# Altium schematic sheet DriverBoard.SchDoc
size C
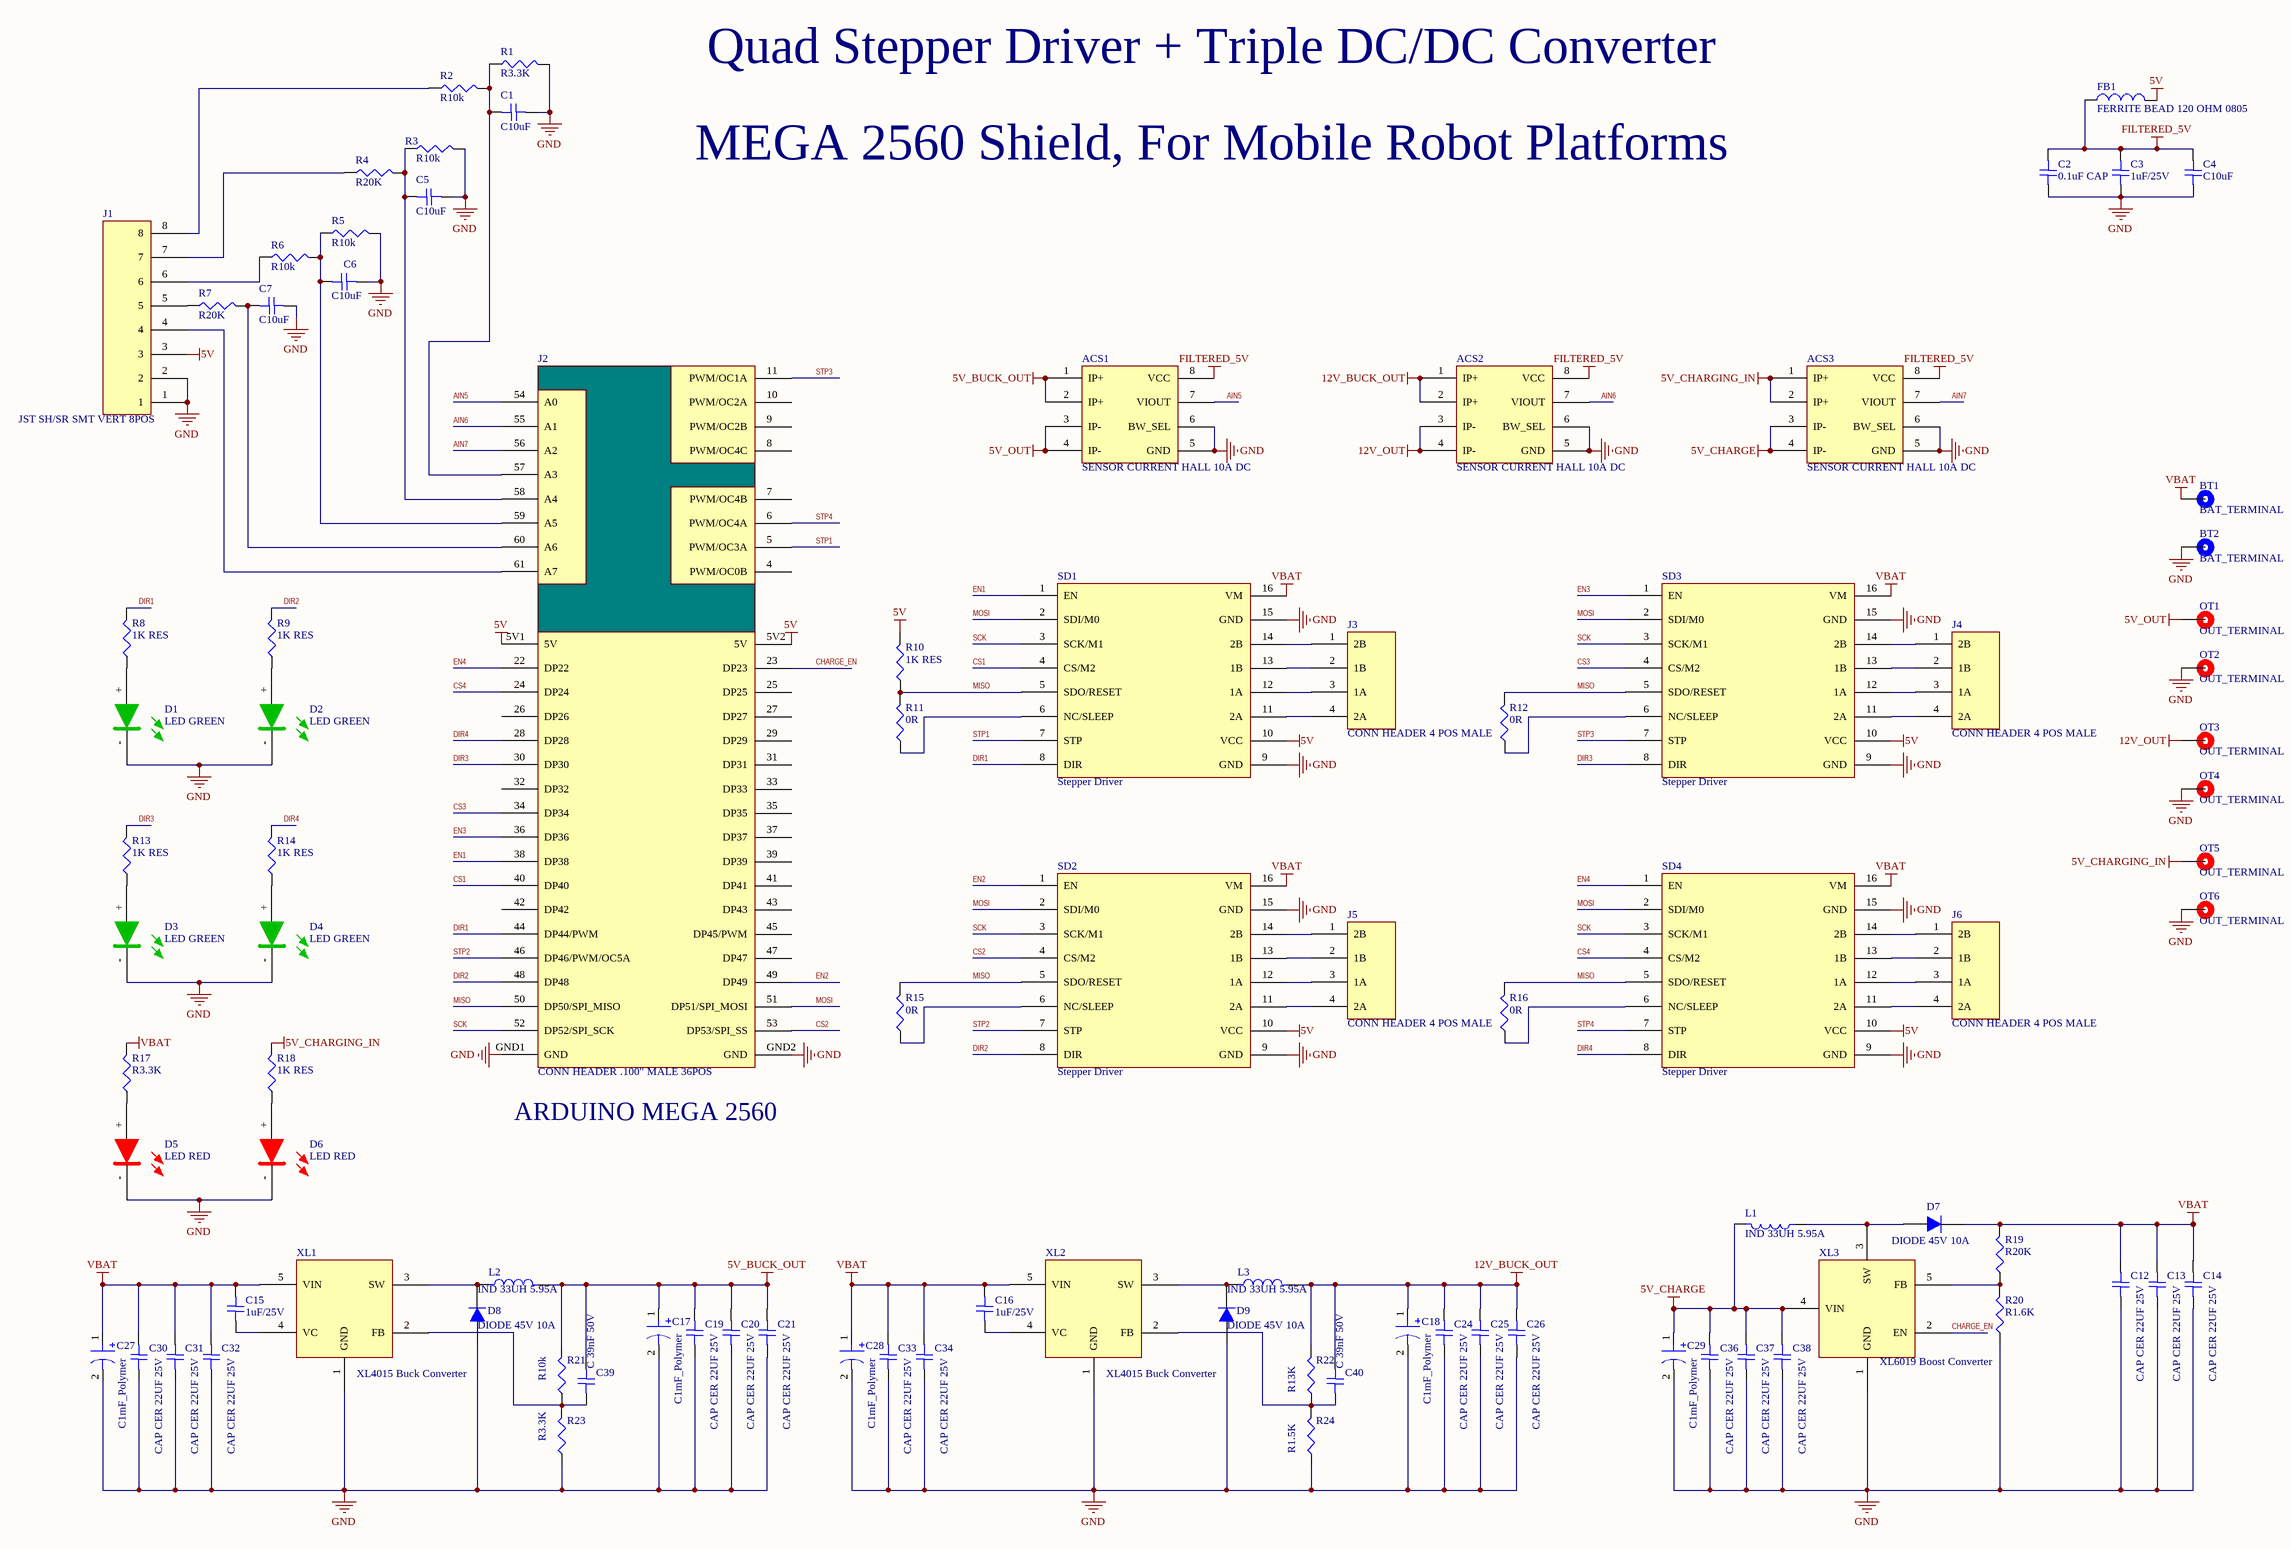
[diagram p0: DriverBoard.SchDoc]

## Parts
ACS1  SENSOR CURRENT HALL 10A DC  [SOIC_8]
ACS2  SENSOR CURRENT HALL 10A DC  [SOIC_8]
ACS3  SENSOR CURRENT HALL 10A DC  [SOIC_8]
BT1  BAT_TERMINAL  [BATTERY_TERMINALS]
BT2  BAT_TERMINAL  [BATTERY_TERMINALS]
C1  C10uF  [C0805]
C2  0.1uF CAP  [C0805]
C3  1uF/25V  [C0805]
C4  C10uF  [C0805]
C5  C10uF  [C0805]
C6  C10uF  [C0805]
C7  C10uF  [C0805]
C12  CAP CER 22UF 25V  [C1210]
C13  CAP CER 22UF 25V  [C1210]
C14  CAP CER 22UF 25V  [C1210]
C15  1uF/25V  [C0805]
C16  1uF/25V  [C0805]
C17  C1mF_Polymer  [POLY_CAP_10X21]
C18  C1mF_Polymer  [POLY_CAP_10X21]
C19  CAP CER 22UF 25V  [C1210]
C20  CAP CER 22UF 25V  [C1210]
C21  CAP CER 22UF 25V  [C1210]
C24  CAP CER 22UF 25V  [C1210]
C25  CAP CER 22UF 25V  [C1210]
C26  CAP CER 22UF 25V  [C1210]
C27  C1mF_Polymer  [POLY_CAP_10X21]
C28  C1mF_Polymer  [POLY_CAP_10X21]
C29  C1mF_Polymer  [POLY_CAP_10X21]
C30  CAP CER 22UF 25V  [C1210]
C31  CAP CER 22UF 25V  [C1210]
C32  CAP CER 22UF 25V  [C1210]
C33  CAP CER 22UF 25V  [C1210]
C34  CAP CER 22UF 25V  [C1210]
C36  CAP CER 22UF 25V  [C1210]
C37  CAP CER 22UF 25V  [C1210]
C38  CAP CER 22UF 25V  [C1210]
C39  C 39nF 50V  [C0805]
C40  C 39nF 50V  [C0805]
D1  LED GREEN  [LED_0805]
D2  LED GREEN  [LED_0805]
D3  LED GREEN  [LED_0805]
D4  LED GREEN  [LED_0805]
D5  LED RED  [LED_0805]
D6  LED RED  [LED_0805]
D7  DIODE 45V 10A  [TO252_3]
D8  DIODE 45V 10A  [TO252_3]
D9  DIODE 45V 10A  [TO252_3]
FB1  FERRITE BEAD 120 OHM 0805  [FB_0805]
J1  JST SH/SR SMT VERT 8POS  [JST_SH_8]
J2  CONN HEADER .100" MALE 36POS  [DIP36_MALE]
J3  CONN HEADER 4 POS MALE  [DIP4]
J4  CONN HEADER 4 POS MALE  [DIP4]
J5  CONN HEADER 4 POS MALE  [DIP4]
J6  CONN HEADER 4 POS MALE  [DIP4]
L1  IND 33UH 5.95A  [13X13X9IND]
L2  IND 33UH 5.95A  [13X13X9IND]
L3  IND 33UH 5.95A  [13X13X9IND]
OT1  OUT_TERMINAL  [OUTPUT_TERMINALS]
OT2  OUT_TERMINAL  [OUTPUT_TERMINALS]
OT3  OUT_TERMINAL  [OUTPUT_TERMINALS]
OT4  OUT_TERMINAL  [OUTPUT_TERMINALS]
OT5  OUT_TERMINAL  [OUTPUT_TERMINALS]
OT6  OUT_TERMINAL  [OUTPUT_TERMINALS]
R1  R3.3K  [R0805]
R2  R10k  [R0805]
R3  R10k  [R0805]
R4  R20K  [R0805]
R5  R10k  [R0805]
R6  R10k  [R0805]
R7  R20K  [R0805]
R8  1K RES  [R0805]
R9  1K RES  [R0805]
R10  1K RES  [R0805]
R11  0R  [R0805]
R12  0R  [R0805]
R13  1K RES  [R0805]
R14  1K RES  [R0805]
R15  0R  [R0805]
R16  0R  [R0805]
R17  R3.3K  [R0805]
R18  1K RES  [R0805]
R19  R20K  [R0805]
R20  R1.6K  [R0805]
R21  R10k  [R0805]
R22  R13K  [R0805]
R23  R3.3K  [R0805]
R24  R1.5K  [R0805]
SD1  Stepper Driver  [DIP16_Stepper]
SD2  Stepper Driver  [DIP16_Stepper]
SD3  Stepper Driver  [DIP16_Stepper]
SD4  Stepper Driver  [DIP16_Stepper]
XL1  XL4015 Buck Converter  [TO263-5L]
XL2  XL4015 Buck Converter  [TO263-5L]
XL3  XL6019 Boost Converter  [TO263-5L]

## Nets
5V: FB1.2 J1.3 J2.5V1(5V) J2.5V2(5V) R10.2 SD1.10(VCC) SD2.10(VCC) SD3.10(VCC) SD4.10(VCC)
5V_BUCK_OUT: ACS1.1(IP+) ACS1.2(IP+) C17.1 C19.2 C20.2 C21.2 C39.2 L2.2 R21.2
5V_CHARGE: ACS3.3(IP-) ACS3.4(IP-) C29.1 C36.2 C37.2 C38.2 L1.2 XL3.4(VIN)
5V_CHARGING_IN: ACS3.1(IP+) ACS3.2(IP+) OT5.1 R18.2
5V_OUT: ACS1.3(IP-) ACS1.4(IP-) OT1.1
12V_BUCK_OUT: ACS2.1(IP+) ACS2.2(IP+) C18.1 C24.2 C25.2 C26.2 C40.2 L3.2 R22.2
12V_OUT: ACS2.3(IP-) ACS2.4(IP-) OT3.1
FILTERED_5V: ACS1.8(VCC) ACS2.8(VCC) ACS3.8(VCC) C2.2 C3.2 C4.2 FB1.1
GND: ACS1.5(GND) ACS1.6(BW_SEL) ACS2.5(GND) ACS2.6(BW_SEL) ACS3.5(GND) ACS3.6(BW_SEL) BT2.1 C1.1 C2.1 C3.1 C4.1 C5.1 C6.1 C7.1 C12.1 C13.1 C14.1 C17.2 C18.2 C19.1 C20.1 C21.1 C24.1 C25.1 C26.1 C27.2 C28.2 C29.2 C30.1 C31.1 C32.1 C33.1 C34.1 C36.1 C37.1 C38.1 D1.- D2.- D3.- D4.- D5.- D6.- D8.1 D9.1 J1.1 J1.2 J2.GND1(GND) J2.GND2(GND) OT2.1 OT4.1 OT6.1 R1.2 R3.2 R5.2 R20.1 R23.1 R24.1 SD1.9(GND) SD1.15(GND) SD2.9(GND) SD2.15(GND) SD3.9(GND) SD3.15(GND) SD4.9(GND) SD4.15(GND) XL1.1(GND) XL2.1(GND) XL3.1(GND)
VBAT: BT1.1 C12.2 C13.2 C14.2 C15.2 C16.2 C27.1 C28.1 C30.2 C31.2 C32.2 C33.2 C34.2 D7.2 R17.2 R19.2 SD1.16(VM) SD2.16(VM) SD3.16(VM) SD4.16(VM) XL1.5(VIN) XL2.5(VIN)
AIN5: ACS1.7(VIOUT) J2.54(A0)
AIN6: ACS2.7(VIOUT) J2.55(A1)
AIN7: ACS3.7(VIOUT) J2.56(A2)
CHARGE_EN: J2.23(DP23) XL3.2(EN)
CS1: J2.40(DP40) SD1.4(CS/M2)
CS2: J2.53(DP53/SPI_SS) SD2.4(CS/M2)
CS3: J2.34(DP34) SD3.4(CS/M2)
CS4: J2.24(DP24) SD4.4(CS/M2)
DIR1: J2.44(DP44/PWM) R8.2 SD1.8(DIR)
DIR2: J2.48(DP48) R9.2 SD2.8(DIR)
DIR3: J2.30(DP30) R13.2 SD3.8(DIR)
DIR4: J2.28(DP28) R14.2 SD4.8(DIR)
EN1: J2.38(DP38) SD1.1(EN)
EN2: J2.49(DP49) SD2.1(EN)
EN3: J2.36(DP36) SD3.1(EN)
EN4: J2.22(DP22) SD4.1(EN)
MISO: J2.50(DP50/SPI_MISO) R10.1 R11.2 R12.2 R15.2 R16.2 SD1.5(SDO/RESET) SD2.5(SDO/RESET) SD3.5(SDO/RESET) SD4.5(SDO/RESET)
MOSI: J2.51(DP51/SPI_MOSI) SD1.2(SDI/M0) SD2.2(SDI/M0) SD3.2(SDI/M0) SD4.2(SDI/M0)
SCK: J2.52(DP52/SPI_SCK) SD1.3(SCK/M1) SD2.3(SCK/M1) SD3.3(SCK/M1) SD4.3(SCK/M1)
STP1: J2.5(PWM/OC3A) SD1.7(STP)
STP2: J2.46(DP46/PWM/OC5A) SD2.7(STP)
STP3: J2.11(PWM/OC1A) SD3.7(STP)
STP4: J2.6(PWM/OC4A) SD4.7(STP)
NetC1_2: C1.2 J2.57(A3) R1.1 R2.2
NetC5_2: C5.2 J2.58(A4) R3.1 R4.2
NetC6_2: C6.2 J2.59(A5) R5.1 R6.2
NetC7_2: C7.2 J2.60(A6) R7.2
NetC15_1: C15.1 XL1.4(VC)
NetC16_1: C16.1 XL2.4(VC)
NetC39_1: C39.1 R21.1 R23.2 XL1.2(FB)
NetC40_1: C40.1 R22.1 R24.2 XL2.2(FB)
NetD1_+: D1.+ R8.1
NetD2_+: D2.+ R9.1
NetD3_+: D3.+ R13.1
NetD4_+: D4.+ R14.1
NetD5_+: D5.+ R17.1
NetD6_+: D6.+ R18.1
NetD7_1: D7.1 L1.1 XL3.3(SW)
NetD8_2: D8.2 L2.1 XL1.3(SW)
NetD9_2: D9.2 L3.1 XL2.3(SW)
NetJ1_4: J1.4 J2.61(A7)
NetJ1_5: J1.5 R7.1
NetJ1_6: J1.6 R6.1
NetJ1_7: J1.7 R4.1
NetJ1_8: J1.8 R2.1
NetJ3_1: J3.1(2B) SD1.14(2B)
NetJ3_2: J3.2(1B) SD1.13(1B)
NetJ3_3: J3.3(1A) SD1.12(1A)
NetJ3_4: J3.4(2A) SD1.11(2A)
NetJ4_1: J4.1(2B) SD3.14(2B)
NetJ4_2: J4.2(1B) SD3.13(1B)
NetJ4_3: J4.3(1A) SD3.12(1A)
NetJ4_4: J4.4(2A) SD3.11(2A)
NetJ5_1: J5.1(2B) SD2.14(2B)
NetJ5_2: J5.2(1B) SD2.13(1B)
NetJ5_3: J5.3(1A) SD2.12(1A)
NetJ5_4: J5.4(2A) SD2.11(2A)
NetJ6_1: J6.1(2B) SD4.14(2B)
NetJ6_2: J6.2(1B) SD4.13(1B)
NetJ6_3: J6.3(1A) SD4.12(1A)
NetJ6_4: J6.4(2A) SD4.11(2A)
NetR11_1: R11.1 SD1.6(NC/SLEEP)
NetR12_1: R12.1 SD3.6(NC/SLEEP)
NetR15_1: R15.1 SD2.6(NC/SLEEP)
NetR16_1: R16.1 SD4.6(NC/SLEEP)
NetR19_1: R19.1 R20.2 XL3.5(FB)

Not connected (* = marked no-connect by the designer): J2 4(PWM/OC0B) 7(PWM/OC4B) 8(PWM/OC4C) 9(PWM/OC2B) 10(PWM/OC2A) 25(DP25) 26(DP26) 27(DP27) 29(DP29) 31(DP31) 32(DP32) 33(DP33) 35(DP35) 37(DP37) 39(DP39) 41(DP41) 42(DP42) 43(DP43) 45(DP45/PWM) 47(DP47)

## Notes on the sheet
- Quad Stepper Driver + Triple DC/DC Converter
- MEGA 2560 Shield, For Mobile Robot Platforms
- (near J2) ARDUINO MEGA 2560

## Library data of the parts
ACS1-ACS3 = ACS723LLCTR-10AU-T: Manufacturer: Allegro MicroSystems; Sensor Type: Hall Effect, Open Loop; Number of Channels: 1; Output: Ratiometric, Voltage; Sensitivity: 400mV/A; Frequency: DC ~ 80kHz; Linearity: ±1%; Accuracy: ±3%; Voltage - Supply: 5V; Response Time: 5µs; Current - Supply (Max): 14mA; Polarization: Unidirectional; Supplier 1: Digi-Key; Manufacturer Part Number: ACS723LLCTR-10AU-T; Stock 1: 1781; Pricing 1: 1=5.27, 5=4.654, 10=4.11, 25=3.3348, 50=2.947, 100=2.8694, 500=2.4041, 1000=2.249 (USD); Category: Sensors, Transducers; Family: Current Transducers; Series: -; Packaging: Tape & Reel (TR); For Measuring: DC; Current - Sensing: 10A; Operating Temperature: -40°C ~ 150°C; Mounting Type: Surface Mount; Package / Case: 8-SOIC (0.154", 3.90mm Width); ComponentLink1URL: http://www.allegromicro.com/~/media/Files/Datasheets/ACS723-Datasheet.ashx?src-supplier=Digi-Key; ComponentLink1Description: http://www.allegromicro.com/~/media/Files/Datasheets/ACS723-Datasheet.ashx?src-supplier=Digi-Key; ComponentLink2URL: https://www.allegromicro.com/~/media/Files/Datasheets/ACS723-Datasheet.ashx?src-supplier=Digi-Key; ComponentLink2Description: https://www.allegromicro.com/~/media/Files/Datasheets/ACS723-Datasheet.ashx?src-supplier=Digi-Key; Supplier Part Number 1: 620-1643-1-ND
C1 C4-C7 = CL21A106KPFNNNG: Cap Ceramic 10uF 10V X5R 10% SMD 0805 85C Embossed T/R; Manufacturer: Samsung; Supplier 1: Digi-Key; Manufacturer Part Number: CL21A106KPFNNNG; Stock 1: 184536; Pricing 1: 1=0.14, 10=0.1, 100=0.0469, 500=0.0329, 1000=0.0272 (USD); Mount: Surface Mount; Case/Package: 0805; Case Code (Metric): 2012; Case Code (Imperial): 0805; Min Operating Temperature: -55°C; Max Operating Temperature: 85°C; Capacitance: 10uF; Tolerance: 10%; Dielectric: X5R; Voltage: 10V; Voltage Rating: 10V; Packaging: Tape and Reel; Package Quantity: 3000; Termination: Wraparound; Length: 2mm; Height: 1.25mm; Depth: 1.25mm; Width: 0.049inch; Thickness: 0.053inch; Radiation Hardening: No; Lead Free: Lead Free; ComponentLink1URL: http://www1.futureelectronics.com/doc/SAMSUNG/CL21A106KPFNNNG.pdf?src-supplier=Future+Electronics; ComponentLink1Description: http://www1.futureelectronics.com/doc/SAMSUNG/CL21A106KPFNNNG.pdf?src-supplier=Future+Electronics; ComponentLink2URL: https://www.verical.com/server-webapp/html/getDatasheet?partID=640497&src-supplier=Verical; ComponentLink2Description: https://www.verical.com/server-webapp/html/getDatasheet?partID=640497&src-supplier=Verical; Supplier Part Number 1: 1276-6456-1-ND
C2 = CL21F104ZBCNNNC: Cap Ceramic 0.1uF 50V Y5V -20% to 80% SMD 0805 85C Paper T/R; Manufacturer: Samsung; Capacitance: 100nF; Supplier 1: Digi-Key; Manufacturer Part Number: CL21F104ZBCNNNC; Stock 1: 5269056; Pricing 1: 1=0.1, 10=0.044, 100=0.0195, 500=0.0139, 1000=0.0109 (USD); Mount: Surface Mount; Case/Package: 0805; Case Code (Metric): 2012; Case Code (Imperial): 0805; Material: Ceramic; Min Operating Temperature: -30°C; Max Operating Temperature: 85°C; Packaging: Tape and Reel; Tolerance: 80%; Voltage Rating: 50V; Package Quantity: 1; Dielectric: Y5V; Length: 2mm; Height: 0.85mm; Width: 0.049inch; Thickness: 0.037inch; Depth: 1.25mm; Radiation Hardening: No; ComponentLink1URL: https://www.verical.com/server-webapp/html/getDatasheet?partID=466953&src-supplier=Verical; ComponentLink1Description: https://www.verical.com/server-webapp/html/getDatasheet?partID=466953&src-supplier=Verical; ComponentLink2URL: https://produktinfo.conrad.com/datenblaetter/450000-474999/454191-da-01-en-VS_KONDENSATOR_0805.pdf?src-supplier=Conrad; ComponentLink2Description: https://produktinfo.conrad.com/datenblaetter/450000-474999/454191-da-01-en-VS_KONDENSATOR_0805.pdf?src-supplier=Conrad; Supplier Part Number 1: 1276-1007-1-ND
C3 C15 C16 = C2012X5R1E105K125AA: CAP CER 1UF 25V X5R 0805; Manufacturer: TDK Corporation; Tolerance: ±10%; Notification: Current market demand for these product types have resulted in fluctuating and extending lead times. Lead times may differ.; Supplier 1: Digi-Key; Manufacturer Part Number: C2012X5R1E105K125AA; RoHS: RoHS Compliant; Category: Capacitors; Stock 1: 774565; Pricing 1: 1=0.18, 10=0.129, 100=0.0605, 500=0.04244, 1000=0.03514 (USD); Packaging: Cut Tape (CT); Part Status: Not For New Designs; Voltage - Rated: 25V; Temperature Coefficient: X5R; Operating Temperature: -55°C ~ 85°C; Features: Low ESL; Ratings: -; Applications: General Purpose; Failure Rate: -; Mounting Type: Surface Mount, MLCC; Package / Case: 0805 (2012 Metric); Size / Dimension: 0.079" L x 0.049" W (2.00mm x 1.25mm); Height - Seated (Max): -; Thickness (Max): 0.057" (1.45mm); Lead Spacing: -; Lead Style: -; ComponentLink1URL: https://product.tdk.com/info/en/catalog/datasheets/mlcc_commercial_general_en.pdf; ComponentLink1Description: https://product.tdk.com/info/en/catalog/datasheets/mlcc_commercial_general_en.pdf; Supplier Part Number 1: 445-1419-1-ND
C12-C14 C19-C21 C24-C26 C30-C34 C36-C38 = CL32A226MAJNNNE: CAP CER 22UF 25V X5R 1210; Manufacturer: Samsung; Product Training Modules: High Cap MLCC Family; Featured Product: Multi-Layer Ceramic Capacitors; Capacitance: 22µF; Tolerance: ±20%; Online Catalog: CL Series, High Capacitance; Other Names: 1276-3373-2; Supplier 1: Digi-Key; Manufacturer Part Number: CL32A226MAJNNNE; Stock 1: 57875; Pricing 1: 1=0.58, 10=0.412, 100=0.2715, 500=0.2011 (USD); RoHS Information: MLCC RoHS 2 Compliance; Standard Package: 1,000; Category: Capacitors; Family: Ceramic Capacitors; Series: CL; Packaging: Tape & Reel (TR); Voltage - Rated: 25V; Temperature Coefficient: X5R; Mounting Type: Surface Mount, MLCC; Operating Temperature: -55°C ~ 85°C; Applications: General Purpose; Ratings: -; Package / Case: 1210 (3225 Metric); Size / Dimension: 0.126" L x 0.098" W (3.20mm x 2.50mm); Height - Seated (Max): -; Thickness (Max): 0.106" (2.70mm); Lead Spacing: -; Features: -; Lead Style: -; ComponentLink1URL: http://www.samsungsem.com/kr/support/product-search/mlcc/CL32A226MAJNNNE.jsp?src-supplier=Digi-Key; ComponentLink1Description: http://www.samsungsem.com/kr/support/product-search/mlcc/CL32A226MAJNNNE.jsp?src-supplier=Digi-Key; Supplier Part Number 1: 1276-3373-1-ND
C17 C18 C27-C29 = APSG200ELL681MJB5S: Cap Aluminum Polymer 680uF 20VDC 20% (10 X 11.5mm) Radial 5mm 0.012 Ohm 5400mA 2000h 105C Bulk; Manufacturer: United Chemi-Con; Featured Product: Chemi-Con / PSG Series; Capacitance: 680µF; Voltage Rating: 20V; Lifetime @ Temp.: 15000 Hrs @ 105°C; Online Catalog: NPCAP™ PSG Series; Other Names: 565-3623 APSG200ELL681MJB5S-ND; Supplier 1: Digi-Key; Manufacturer Part Number: APSG200ELL681MJB5S; Stock 1: 499; Pricing 1: 1=2.14, 10=1.73, 100=1.3209, 500=1.0064, 1000=0.8806, 2500=0.8554 (USD); Standard Package: 500; Category: Capacitors; Family: Aluminum - Polymer Capacitors; Series: NPCAP™-PSG; Packaging: Bulk; Tolerance: ±20%; ESR (Equivalent Series Resistance): -; Operating Temperature: -55°C ~ 105°C; Type: Polymer; Applications: -; Ripple Current: -; Impedance: -; Lead Spacing: 0.197" (5.00mm); Size / Dimension: 0.394" Dia (10.00mm); Height - Seated (Max): 0.512" (13.00mm); Surface Mount Land Size: -; Mounting Type: Through Hole; Package / Case: Radial, Can; Supplier Part Number 1: 565-3623-ND
C39 C40 = C0805C393K5RACTU: Multilayer Ceramic Capacitors 50volts 39000pF X7R 10%; Manufacturer: KEMET; Capacitance Value: 0.039 uF; Voltage: 50 Vdc; Product Length: 2 mm; Product Height: 0.78 mm; Product Depth: 1.25 mm; Supplier 1: Digi-Key; Manufacturer Part Number: C0805C393K5RACTU; Stock 1: 17723; Pricing 1: 1=0.23, 10=0.155, 100=0.0784, 500=0.0536, 1000=0.0474 (USD); Package/Case: 0805; Mounting: Surface Mount; Tolerance: 10 %; Dielectric: X7R; Operating Temperature: -55 to 125 °C; Construction: Flat; Category: Capacitor Ceramic Multilayer; ComponentLink1URL: http://www.mouser.com/ds/2/212/KEM_C1002_X7R_SMD-1102033.pdf?src-supplier=Mouser; ComponentLink1Description: http://www.mouser.com/ds/2/212/KEM_C1002_X7R_SMD-1102033.pdf?src-supplier=Mouser; Supplier Part Number 1: 399-8076-1-ND
D1-D4 = LTST-C171GKT: LED GREEN CLEAR CHIP SMD; Manufacturer: Vishay Lite-On; Lens Color: Colorless; Viewing Angle: 130°; Lens Style: Diffused,Colorless,Rectangular,Clear; Luminous Intensity: 12mcd; Forward Current: 30mA; Forward Voltage: 2.1V; Power Rating: 100mW; Dominant Wavelength: 569nm; Test Current: 10mA; Number of Elements: 1; Wavelength: 585nm; Reverse Voltage: 5V; Supplier 1: Digi-Key; Manufacturer Part Number: LTST-C171GKT; Stock 1: 262269; Pricing 1: 1=0.29, 10=0.211, 25=0.1556, 100=0.1111, 250=0.0756, 500=0.0667, 1000=0.0522 (USD); Mount: Surface Mount; Case/Package: 0805; Number of Pins: 2; Color: Green; Case Code (Metric): 2012; Case Code (Imperial): 0805; Min Operating Temperature: -55°C; Max Operating Temperature: 85°C; Package Quantity: 1; Packaging: Tape and Reel; Illumination Color: Green; Lens Transparency: Clear; Power Dissipation: 100mW; Number of LEDs: 1; Length: 2mm; Height: 0.8mm; Width: 1.25mm; Depth: 1.25mm; Radiation Hardening: No; Lead Free: Lead Free; ComponentLink1URL: https://media.digikey.com/pdf/Data%20Sheets/Lite-On%20PDFs/LTST-C171GKT.pdf?src-supplier=Digi-Key; ComponentLink1Description: https://media.digikey.com/pdf/Data%20Sheets/Lite-On%20PDFs/LTST-C171GKT.pdf?src-supplier=Digi-Key; ComponentLink2URL: http://www1.futureelectronics.com/doc/LITE-ON/LTST-C171GKT.pdf?src-supplier=Future+Electronics; ComponentLink2Description: http://www1.futureelectronics.com/doc/LITE-ON/LTST-C171GKT.pdf?src-supplier=Future+Electronics; ComponentLink3URL: http://uk.rs-online.com/webdocs/0dc0/0900766b80dc0296.pdf?src-supplier=RSComponents; ComponentLink3Description: http://uk.rs-online.com/webdocs/0dc0/0900766b80dc0296.pdf?src-supplier=RSComponents; ComponentLink4URL: http://www.mouser.com/ds/2/239/Lite-On-LTST-C171GKT-190133.pdf?src-supplier=Mouser; ComponentLink4Description: http://www.mouser.com/ds/2/239/Lite-On-LTST-C171GKT-190133.pdf?src-supplier=Mouser; Supplier Part Number 1: 160-1423-1-ND
D5 D6 = LTST-C171KRKT: LED RED CLEAR SMD; Manufacturer: Vishay Lite-On; Chip Material: AlGaInP; DELETED: Compliant; Dominant Wave Length: 631 nm; Forward Current: 30 mA; Forward Voltage: 2.4 V; High Brightness: Yes; Lum Intensity: 54mcd; Main Category: Chip LED; Number of  Elements: 1; Peak Wavelength: 639 nm; Power Dissipation: 75 W; Product Depth (mm): 1.25 mm; Product Height (mm): 0.8 mm; Product Length (mm): 2 mm; Rad Hardened: No; Reverse Voltage: 5 V; Shape Type: Rectangular; Test Current (It): 20 mA; Type: Uni-Color; Viewing Angle: 130 deg; Supplier 1: Digi-Key; Manufacturer Part Number: LTST-C171KRKT; Stock 1: 82154; Pricing 1: 1=0.29, 10=0.215, 100=0.1016, 500=0.0677, 1000=0.0531 (USD); Emitting Color: Red; Lens Dimensions: 1.4x1.25x0.5 mm; Luminous Intensity: 54mcd; Mounting: Surface Mount; Operating Temp Range: -55C to 85C; Operating Temperature Classification: Industrial; Package Type: Chip Led; Packaging: Tape and Reel; Pin Count: 2; ComponentLink1URL: http://optoelectronics.liteon.com/upload/download/DS22-2000-109/LTST-C171KRKT.pdf?src-supplier=Digi-Key; ComponentLink1Description: http://optoelectronics.liteon.com/upload/download/DS22-2000-109/LTST-C171KRKT.pdf?src-supplier=Digi-Key; ComponentLink2URL: http://www.mouser.com/ds/2/239/Lite-On-LTST-C171KRKT-187201.pdf?src-supplier=Mouser; ComponentLink2Description: http://www.mouser.com/ds/2/239/Lite-On-LTST-C171KRKT-187201.pdf?src-supplier=Mouser; ComponentLink3URL: http://uk.rs-online.com/webdocs/0dc0/0900766b80dc0550.pdf?src-supplier=RSComponents; ComponentLink3Description: http://uk.rs-online.com/webdocs/0dc0/0900766b80dc0550.pdf?src-supplier=RSComponents; ComponentLink4URL: http://www1.futureelectronics.com/doc/LITE%20ON/LITE-ON%20LTST-C171KRKT.pdf?src-supplier=Future+Electronics; ComponentLink4Description: http://www1.futureelectronics.com/doc/LITE%20ON/LITE-ON%20LTST-C171KRKT.pdf?src-supplier=Future+Electronics; Supplier Part Number 1: 160-1427-1-ND
D7-D9 = MBRD1045T4G: DIODE SCHOTTKY 45V 10A DPAK; Manufacturer: ON Semiconductor; PCN Assembly/Origin: Qualification Assembly/Test Site 13/Mar/2014; Voltage - Forward (Vf) (Max) @ If: 840mV @ 20A; Speed: Fast Recovery =  200mA (Io); Current - Reverse Leakage @ Vr: 100µA @ 45V; Online Catalog: Schottky Diode; Other Names: MBRD1045T4GOSDKR; Supplier 1: Digi-Key; Manufacturer Part Number: MBRD1045T4G; Stock 1: 4441; Pricing 1: 1=0.72, 10=0.631, 100=0.4299, 500=0.3592, 1000=0.3057 (USD); Standard Package: 1; Category: Discrete Semiconductor Products; Family: Diodes, Rectifiers - Single; Series: SWITCHMODE™; Packaging: Digi-Reel®; Diode Type: Schottky; Voltage - DC Reverse (Vr) (Max): 45V; Current - Average Rectified (Io): 10A; Reverse Recovery Time (trr): -; Capacitance @ Vr, F: -; Mounting Type: Surface Mount; Package / Case: TO-252-3, DPak (2 Leads + Tab), SC-63; Supplier Device Package: DPAK; Operating Temperature - Junction: -65°C ~ 175°C; ComponentLink1URL: http://www.onsemi.cn/pub_link/Collateral/MBRB1045-D.PDF?src-supplier=Avnet; ComponentLink1Description: http://www.onsemi.cn/pub_link/Collateral/MBRB1045-D.PDF?src-supplier=Avnet; ComponentLink2URL: http://uk.rs-online.com/webdocs/1221/0900766b812212c8.pdf?src-supplier=RSComponents; ComponentLink2Description: http://uk.rs-online.com/webdocs/1221/0900766b812212c8.pdf?src-supplier=RSComponents; ComponentLink3URL: http://www.onsemi.com/pub/Collateral/MBRB1045-D.PDF?src-supplier=Future+Electronics; ComponentLink3Description: http://www.onsemi.com/pub/Collateral/MBRB1045-D.PDF?src-supplier=Future+Electronics; ComponentLink4URL: http://www.onsemi.com/pub/Collateral/MBRB1045-D.PDF?src-supplier=Digi-Key; ComponentLink4Description: http://www.onsemi.com/pub/Collateral/MBRB1045-D.PDF?src-supplier=Digi-Key; ComponentLink5URL: http://www.onsemi.cn/pub_link/Collateral/MBRB1045-D.PDF?src-supplier=Avnet+Europe; ComponentLink5Description: http://www.onsemi.cn/pub_link/Collateral/MBRB1045-D.PDF?src-supplier=Avnet+Europe; ComponentLink6URL: http://datasheet.iiic.cc/on_semiconductor/MBRD1045T4G.pdf?src-supplier=IIIC; ComponentLink6Description: http://datasheet.iiic.cc/on_semiconductor/MBRD1045T4G.pdf?src-supplier=IIIC; Supplier Part Number 1: MBRD1045T4GOSCT-ND
FB1 = 742792023: FERRITE BEAD 120 OHM 0805 1LN; Manufacturer: Wurth Electronics; Current Rating: 3A; Inductance: 1H; Tolerance: 25%; Impedance: 120R; Number of Lines: 1; DC Resistance (DCR): 30mR; Test Frequency: 100MHz; Shielding: Unshielded; Supplier 1: Digi-Key; Manufacturer Part Number: 742792023; Stock 1: 64621; Pricing 1: 1=0.22, 50=0.21, 100=0.193, 500=0.185, 1000=0.176, 2000=0.168 (USD); Mount: Surface Mount; Case/Package: SMD/SMT; Weight: 0.000388oz; Core Material: Ferrite; Case Code (Metric): 2012; Case Code (Imperial): 0805; Min Operating Temperature: -55°C; Max Operating Temperature: 125°C; Package Quantity: 1; Packaging: Tape and Reel; Max Current Rating: 3A; Max DC Current: 3A; Termination: SMD/SMT; Length: 2mm; Height: 0.9mm; Width: 0.047inch; Depth: 1.2mm; REACH SVHC: Unknown; Lead Free: Lead Free; ComponentLink1URL: https://katalog.we-online.de/pbs/datasheet/742792023.pdf?src-supplier=Digi-Key; ComponentLink1Description: https://katalog.we-online.de/pbs/datasheet/742792023.pdf?src-supplier=Digi-Key; ComponentLink2URL: http://www.farnell.com/datasheets/1695980.pdf?src-supplier=Element14; ComponentLink2Description: http://www.farnell.com/datasheets/1695980.pdf?src-supplier=Element14; ComponentLink3URL: http://www.farnell.com/datasheets/1919974.pdf?src-supplier=Newark; ComponentLink3Description: http://www.farnell.com/datasheets/1919974.pdf?src-supplier=Newark; ComponentLink4URL: http://documents.rs-components.com/techlib://itc_doclist_GB.htm?stockno=3586771&src-supplier=RSComponents; ComponentLink4Description: http://documents.rs-components.com/techlib://itc_doclist_GB.htm?stockno=3586771&src-supplier=RSComponents; ComponentLink5URL: http://www.mouser.com/ds/2/445/742792023-537937.pdf?src-supplier=Mouser; ComponentLink5Description: http://www.mouser.com/ds/2/445/742792023-537937.pdf?src-supplier=Mouser; ComponentLink6URL: http://www.produktinfo.conrad.com/datenblaetter/1000000-1099999/001086956-da-01-ml-WE_CBF_SMD_FERRIT_742792023_de_en.pdf?src-supplier=Conrad; ComponentLink6Description: http://www.produktinfo.conrad.com/datenblaetter/1000000-1099999/001086956-da-01-ml-WE_CBF_SMD_FERRIT_742792023_de_en.pdf?src-supplier=Conrad; Supplier Part Number 1: 732-1613-1-ND
J1 = 08SR-3S: CONN RCPT SR 8 POS 1.0MM TIN; Connector Type: Receptacle; Number of Positions: 8; Pitch: 0.039" (1.00mm); Cable Termination: IDC; Wire Type: Discrete; Wire Gauge: 30 AWG; Supplier 1: Digi-Key; Manufacturer: JST; Manufacturer Part Number: 08SR-3S; Stock 1: 1705; Pricing 1: 1=0.55, 10=0.512, 25=0.4612, 50=0.4098, 100=0.3928, 250=0.3586, 500=0.3416, 1000=0.2818, 2500=0.2562 (USD); Category: Connectors, Interconnects; Family: Rectangular Connectors - Free Hanging, Panel Mount; Series: SR; Packaging: Bulk; Contact Type: Female Socket; Number of Rows: 1; Row Spacing: -; Mounting Type: Free Hanging (In-Line); Fastening Type: -; Features: Closed End; Contact Finish: Tin; Contact Finish Thickness: -; Color: Natural; ComponentLink1URL: http://www.jst-mfg.com/product/pdf/eng/eSR.pdf?src-supplier=Digi-Key; ComponentLink1Description: http://www.jst-mfg.com/product/pdf/eng/eSR.pdf?src-supplier=Digi-Key; Supplier Part Number 1: 455-2189-ND
J2 = PREC018DAAN-RC: CONN HEADER .100" DUAL STR 36POS; Manufacturer: Sullins; Connector Type: Header, Unshrouded, Breakaway; Number of Positions: 36; Number of Positions Loaded: All; Pitch: 0.100" (2.54mm); Online Catalog: 0.100" (2.54mm) Pitch Connector Headers; Other Names: S9500E-18  S9500E-18-ND; Supplier 1: Digi-Key; Manufacturer Part Number: PREC018DAAN-RC; Stock 1: 154; Pricing 1: 1=0.69, 10=0.643, 25=0.5788, 50=0.5146, 100=0.4931, 250=0.4502, 500=0.4288 (USD); Standard Package: 1; Category: Connectors, Interconnects; Family: Rectangular Connectors - Headers, Male Pins; Series: -; Packaging: Bulk; Contact Type: Male Pin; Number of Rows: 2; Row Spacing: 0.100" (2.54mm); Contact Mating Length: 0.230" (5.84mm); Mounting Type: Through Hole; Termination: Solder; Fastening Type: -; Features: -; Contact Finish: Tin; Contact Finish Thickness: -; Color: Black; ComponentLink1URL: https://drawings-pdf.s3.amazonaws.com/11636.pdf?src-supplier=Digi-Key; ComponentLink1Description: https://drawings-pdf.s3.amazonaws.com/11636.pdf?src-supplier=Digi-Key; Supplier Part Number 1: S2012EC-18-ND
J3-J6 = PREC004SAAN-RC: CONN HEADER VERT 4POS 2.54MM; Manufacturer: Sullins; Connector Type: Header, Unshrouded, Breakaway; Number of Positions: 4; Number of Positions Loaded: All; Pitch: 0.100" (2.54mm); Online Catalog: 0.100" (2.54mm) Pitch Connector Headers; Other Names: S9499E-04  S9499E-04-ND; Supplier 1: Digi-Key; Manufacturer Part Number: PREC004SAAN-RC; Stock 1: 2480; Pricing 1: 1=0.12, 10=0.112, 25=0.0832, 50=0.0712, 100=0.0689, 250=0.0594, 500=0.057 (USD); Standard Package: 1; Category: Connectors, Interconnects; Family: Rectangular Connectors - Headers, Male Pins; Series: -; Packaging: Bulk; Contact Type: Male Pin; Number of Rows: 1; Row Spacing: -; Contact Mating Length: 0.230" (5.84mm); Mounting Type: Through Hole; Termination: Solder; Fastening Type: -; Features: -; Contact Finish: Tin; Contact Finish Thickness: -; Color: Black; ComponentLink1URL: https://media.digikey.com/PDF/Data%20Sheets/Sullins%20PDFs/z%20RzCzzzSzzN-RC,%20ST,11635-B.pdf?src-supplier=Digi-Key; ComponentLink1Description: https://media.digikey.com/PDF/Data%20Sheets/Sullins%20PDFs/z%20RzCzzzSzzN-RC,%20ST,11635-B.pdf?src-supplier=Digi-Key; Supplier Part Number 1: S1012EC-04-ND
L1-L3 = SER1390-333MLD: COILCRAFT   SER1390-333MLD   INDUCTOR, 33UH, 5.95A, 20%, 15.7MHZ,REEL; SVHC: To Be Advised; Product Range: COILCRAFT - SER1390 Series; Inductance: 33µH; DC Resistance Max: 0.0231ohm; Inductor Case Style: SMD; Core Material: Ferrite; Supplier 1: Mouser; Manufacturer: Coilcraft; Manufacturer Part Number: SER1390-333MLD; Stock 1: 434; Pricing 1: 1=2.66, 10=2.37, 50=2.13, 100=1.9, 200=1.76, 300=1.49, 900=1.4, 1800=1.28 (USD); Inductance Tolerance: ± 20%; DC Current Rating: 5.95A; Self Resonant Frequency: 15.7MHz; MSL: MSL 1 - Unlimited; ComponentLink1URL: http://www.farnell.com/datasheets/1722556.pdf?src-supplier=Element14; ComponentLink1Description: http://www.farnell.com/datasheets/1722556.pdf?src-supplier=Element14; Supplier Part Number 1: 994-SER1390-333MLD
R1 R17 R23 = RC0805FR-073K3L: RES SMD 3.3K OHM 1% 1/8W 0805; Manufacturer: Yageo; Resistance: 3.3 kOhms; Power Rating: 125 mW (1/8 W); Temperature Coefficient: 100 PPM / C; Voltage Rating: 150 V; Unit Weight: 0.000194 oz; Supplier 1: Digi-Key; Manufacturer Part Number: RC0805FR-073K3L; Stock 1: 641518; Pricing 1: 1=0.1, 10=0.04, 100=0.0163, 1000=0.0073, 2500=0.0064 (USD); Product Category: Thick Film Resistors; RoHS: True; Brand: Yageo; Tolerance: 1 %; Case Code - in: 0805; Case Code - mm: 2012; Operating Temperature Range: - 55 C to + 155 C; Series: RC; Height: 0.5 mm; Length: 2 mm; Package / Case: 0805 (2012 metric); Packaging: Reel; Product: Thick Film Resistors General Purpose; Termination Style: SMD/SMT; Type: General Purpose Chip Resistor Surface Mount; Width: 1.25 mm; ComponentLink1URL: http://www.farnell.com/datasheets/2167052.pdf?src-supplier=Element14; ComponentLink1Description: http://www.farnell.com/datasheets/2167052.pdf?src-supplier=Element14; ComponentLink2URL: http://www.yageo.com/documents/recent/PYu-RC_Group_51_RoHS_L_9.pdf?src-supplier=Digi-Key; ComponentLink2Description: http://www.yageo.com/documents/recent/PYu-RC_Group_51_RoHS_L_9.pdf?src-supplier=Digi-Key; ComponentLink3URL: http://www.yageo.com/documents/recent/PYu-RC_Group_51_RoHS_L_10.pdf?src-supplier=Digi-Key; ComponentLink3Description: http://www.yageo.com/documents/recent/PYu-RC_Group_51_RoHS_L_10.pdf?src-supplier=Digi-Key; ComponentLink4URL: http://www.yageo.ru/pdf/RC0805.pdf?src-supplier=Future+Electronics; ComponentLink4Description: http://www.yageo.ru/pdf/RC0805.pdf?src-supplier=Future+Electronics; ComponentLink5URL: http://www.mouser.com/ds/2/447/RC0805-257173.pdf?src-supplier=Mouser; ComponentLink5Description: http://www.mouser.com/ds/2/447/RC0805-257173.pdf?src-supplier=Mouser; Supplier Part Number 1: 311-3.30KCRCT-ND
R2 R3 R5 R6 R21 = RC0805FR-0710KL: RES SMD 10K OHM 1% 1/8W 0805; Manufacturer: Yageo; Power (Watts): 0.125W, 1/8W; Temperature Coefficient: ±100ppm/°C; Supplier 1: Digi-Key; Manufacturer Part Number: RC0805FR-0710KL; RoHS: RoHS Compliant; Category: Resistors; Stock 1: 19497418; Pricing 1: 1=0.1, 10=0.022, 100=0.0088, 1000=0.00396, 2500=0.00344 (USD); Packaging: Cut Tape (CT); Part Status: Active; Tolerance: ±1%; Composition: Thick Film; Features: Moisture Resistant; Operating Temperature: -55°C ~ 155°C; Package / Case: 0805 (2012 Metric); Supplier Device Package: 0805; Size / Dimension: 0.079" L x 0.049" W (2.00mm x 1.25mm); Height - Seated (Max): 0.024" (0.60mm); Failure Rate: -; ComponentLink1URL: http://www.yageo.com/documents/recent/PYu-RC_Group_51_RoHS_L_8.pdf; ComponentLink1Description: http://www.yageo.com/documents/recent/PYu-RC_Group_51_RoHS_L_8.pdf; Supplier Part Number 1: 311-10.0KCRCT-ND
R4 R7 R19 = RT0805BRC0720KL: RES SMD 20K OHM 0.1% 1/8W 0805; Manufacturer: Yageo; Resistance: 20 kOhms; Power Rating: 125 mW (1/8 W); Temperature Coefficient: 15 PPM / C; Voltage Rating: 150 V; Unit Weight: 0.000194 oz; Supplier 1: Digi-Key; Manufacturer Part Number: RT0805BRC0720KL; Stock 1: 3964; Pricing 1: 1=0.81, 10=0.674, 100=0.4527, 1000=0.2649, 2500=0.2562 (USD); Product Category: Thin Film Resistors - SMD; RoHS: True; Tolerance: 0.1 %; Case Code - in: 0805; Case Code - mm: 2012; Operating Temperature Range: - 55 C to + 125 C; Series: RT; Packaging: Reel; Brand: Yageo; Height: 0.5 mm; Length: 2 mm; Package / Case: 0805 (2012 metric); Product: Thin Film Resistors SMD; Termination Style: SMD/SMT; Type: High Precision, High Stability; Width: 1.25 mm; ComponentLink1URL: http://www.yageo.com/documents/recent/PYu-RT_1-to-0.01_RoHS_L_9.pdf?src-supplier=Digi-Key; ComponentLink1Description: http://www.yageo.com/documents/recent/PYu-RT_1-to-0.01_RoHS_L_9.pdf?src-supplier=Digi-Key; ComponentLink2URL: http://www.mouser.com/ds/2/447/PYu-RT_1-to-0.05_RoHS_L_4-14067.pdf?src-supplier=Mouser; ComponentLink2Description: http://www.mouser.com/ds/2/447/PYu-RT_1-to-0.05_RoHS_L_4-14067.pdf?src-supplier=Mouser; Supplier Part Number 1: 311-20KNFCT-ND
R8-R10 R13 R14 R18 = RNCP0805FTD1K00: RES 1K OHM 1% 1/4W 0805; Manufacturer: Stackpole Electronics; Resistance: 1kR; Power Rating: 250mW; Temperature Coefficient: 100ppm/°C; Supplier 1: Digi-Key; Manufacturer Part Number: RNCP0805FTD1K00; Stock 1: 626879; Pricing 1: 1=0.1, 10=0.072, 100=0.0277, 1000=0.0122, 2500=0.0105 (USD); Mount: Surface Mount; Case/Package: 0805; Case Code (Metric): 2012; Case Code (Imperial): 0805; Min Operating Temperature: -55°C; Max Operating Temperature: 155°C; Tolerance: 1%; Packaging: Tape and Reel; Composition: Thin Film; Number of Terminations: 2; Max Power Dissipation: 250mW; Features: Moisture Resistant,Anti-Sulfur; Length: 0.079inch; Height: 0.024inch; Width: 0.049inch; Lead Free: Lead Free; Supplier Part Number 1: RNCP0805FTD1K00DKR-ND
R11 R12 R15 R16 = RC0805JR-070RL: RES SMD 0 OHM JUMPER 1/8W 0805; Manufacturer: Yageo; Power (Watts): 0.125W, 1/8W; Supplier 1: Digi-Key; Manufacturer Part Number: RC0805JR-070RL; RoHS: RoHS Compliant; Category: Resistors; Stock 1: 699255; Pricing 1: 1=0.1, 10=0.018, 25=0.0128, 50=0.0096, 100=0.0071, 250=0.00544, 500=0.00436, 1000=0.00321 (USD); Packaging: Cut Tape (CT); Part Status: Active; Tolerance: Jumper; Composition: Thick Film; Features: Moisture Resistant; Temperature Coefficient: -; Operating Temperature: -55°C ~ 155°C; Package / Case: 0805 (2012 Metric); Supplier Device Package: 0805; Size / Dimension: 0.079" L x 0.049" W (2.00mm x 1.25mm); Height - Seated (Max): 0.024" (0.60mm); Failure Rate: -; ComponentLink1URL: http://www.yageo.com/documents/recent/PYu-RC_Group_51_RoHS_L_8.pdf; ComponentLink1Description: http://www.yageo.com/documents/recent/PYu-RC_Group_51_RoHS_L_8.pdf; Supplier Part Number 1: 311-0.0ARCT-ND
R20 = RC0805FR-071K6L: RES SMD 1.6K OHM 1% 1/8W 0805; Manufacturer: Yageo; Resistance: 1.6 kOhms; Power Rating: 125 mW (1/8 W); Voltage Rating: 150 V; Temperature Coefficient: 100 PPM / C; Supplier 1: Digi-Key; Manufacturer Part Number: RC0805FR-071K6L; Stock 1: 362810; Pricing 1: 1=0.1, 10=0.04, 100=0.0163, 1000=0.0073, 2500=0.0064 (USD); Termination Style: SMD/SMT; Product: Thick Film Resistors General Purpose; Tolerance: 1 %; Case Code - in: 0805; Case Code - mm: 2012; Series: RC; Operating Temperature Range: - 55 C to + 155 C; Packaging: Reel; ComponentLink1URL: http://documents.rs-components.com/techlib://itc_doclist_GB.htm?stockno=6183678&src-supplier=RSComponents; ComponentLink1Description: http://documents.rs-components.com/techlib://itc_doclist_GB.htm?stockno=6183678&src-supplier=RSComponents; Supplier Part Number 1: 311-1.60KCRCT-ND
R22 = RC0805FR-0713KL: RES SMD 13K OHM 1% 1/8W 0805; Manufacturer: Yageo; Product Training Modules: Chip Resistor; Catalog Drawings: Thick Film Resistor Side; PCN Other: RC/AC 0603/0805/1206 22/Jan/2013; HTML Datasheet: RC Series, L Suffix Datasheet.html; EDA / CAD Models: Download from Accelerated Designs; Power (Watts): 0.125W, 1/8W; Temperature Coefficient: ±100ppm/°C; Online Catalog: RC0805 Series; Kits: PHC5A-KIT-ND  - RESISTOR KIT 10K-97.6K 1/8W PHC5-KIT-ND  - RESISTOR KIT 10K-97.6K 1/8W; Other Names: 311-13.0KCRCT; Supplier 1: Digi-Key; Manufacturer Part Number: RC0805FR-0713KL; Stock 1: 335103; Pricing 1: 1=0.1, 10=0.04, 100=0.0163, 1000=0.0073, 2500=0.0064 (USD); Standard Package: 1; Category: Resistors; Family: Chip Resistor - Surface Mount; Series: RC; Packaging: Cut Tape (CT); Resistance (Ohms): 13k; Tolerance: ±1%; Composition: Thick Film; Features: Moisture Resistant; Operating Temperature: -55°C ~ 155°C; Package / Case: 0805 (2012 Metric); Supplier Device Package: 0805; Size / Dimension: 0.079" L x 0.049" W (2.00mm x 1.25mm); Height: 0.024" (0.60mm); Number of Terminations: 2; ComponentLink1URL: http://documents.rs-components.com/techlib://itc_doclist_GB.htm?stockno=6185337&src-supplier=RSComponents; ComponentLink1Description: http://documents.rs-components.com/techlib://itc_doclist_GB.htm?stockno=6185337&src-supplier=RSComponents; ComponentLink2URL: http://www.yageo.com.tw/exep/pages/download/literatures/PYu-R_INT-thick_7.pdf?src-supplier=Digi-Key; ComponentLink2Description: http://www.yageo.com.tw/exep/pages/download/literatures/PYu-R_INT-thick_7.pdf?src-supplier=Digi-Key; ComponentLink3URL: http://www.yageo.com/documents/recent/PYu-RC_Group_51_RoHS_L_9.pdf?src-supplier=Digi-Key; ComponentLink3Description: http://www.yageo.com/documents/recent/PYu-RC_Group_51_RoHS_L_9.pdf?src-supplier=Digi-Key; ComponentLink4URL: http://www.yageo.ru/pdf/RC0805.pdf?src-supplier=Future+Electronics; ComponentLink4Description: http://www.yageo.ru/pdf/RC0805.pdf?src-supplier=Future+Electronics; ComponentLink5URL: https://www.verical.com/server-webapp/html/getDatasheet?partID=329342&src-supplier=Verical; ComponentLink5Description: https://www.verical.com/server-webapp/html/getDatasheet?partID=329342&src-supplier=Verical; Supplier Part Number 1: 311-13.0KCRCT-ND
R24 = RC0805FR-071K5L: RES SMD 1.5K OHM 1% 1/8W 0805; Manufacturer: Yageo; Voltage Rating: 150V; Resistor Case Style: 0805 [2012 Metric]; Power Rating: 250mW; Product Range: RC Series; Resistor Element Type: Thick Film; Temperature Coefficient: ± 100ppm/°C; SVHC: To Be Advised; Supplier 1: Digi-Key; Manufacturer Part Number: RC0805FR-071K5L; Stock 1: 2063144; Pricing 1: 1=0.1, 10=0.04, 100=0.0163, 1000=0.0073, 2500=0.0064 (USD); Resistance: 1.5kohm; Resistance Tolerance: ± 1%; Packaging: Cut Tape; Automotive Qualification Standard: -; MSL: MSL 1 - Unlimited; ComponentLink1URL: http://www.yageo.ru/pdf/RC0805.pdf?src-supplier=Future+Electronics; ComponentLink1Description: http://www.yageo.ru/pdf/RC0805.pdf?src-supplier=Future+Electronics; Supplier Part Number 1: 311-1.50KCRCT-ND
SD1-SD4 = SilentStepStick_BigTreeTech_TMC2130V1.1: TMC2130, DRV8825, TB67S109, A4988
XL1 XL2 = XL4015: XL Semi Buck Converter, not available in USA
XL3 = XL6019: XL Semi Boost Converter, not available in USA